# EAGLE design arduino-ss-usbmod-zif (EAGLE 7.7.0)
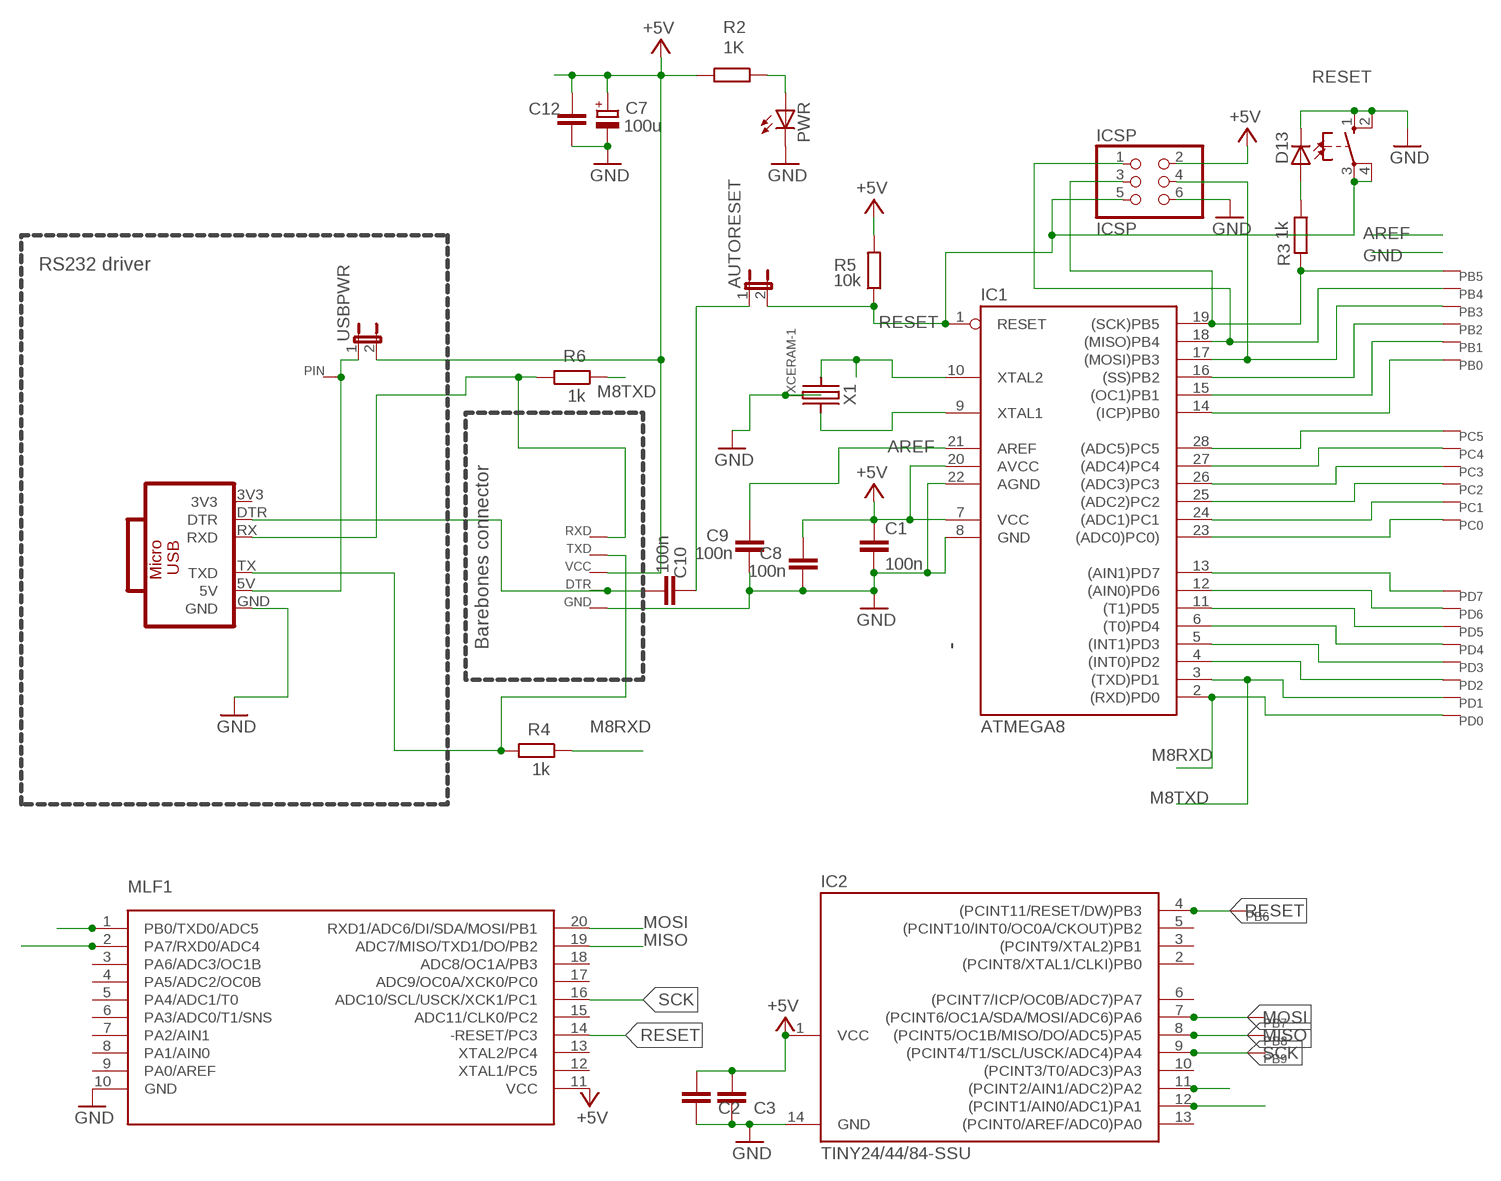
[diagram p0: schematic, sheet 1]

## Parts
AUTORESET  JUMPER-2PTH  [1X02]
C1  100n  C-EU050-025X075  [C050-025X075]
C2  100n  C-EU050-025X075  [C050-025X075]
C3  100n  C-EUC1812  [C1812]
C7  100u  CPOL-EUE3.5-8  [E3,5-8]
C8  100n  C-EU050-025X075  [C050-025X075]
C9  100n  C-EU050-025X075  [C050-025X075]
C10  100n  C-EU050-025X075  [C050-025X075]
C12  100n  C-EU050-025X075  [C050-025X075]
D13  LED3MM  [LED3MM]
DTR  WIRER  [GENERIC-RD-1]
GND  WIRER  [GENERIC-RD-1]
IC1  ATMEGA8  AT90S4433ZIF  [ZIF28/3]
IC2  TINY24/44/84-SSU  [SOIC14]
ICSP  ICSP  PINHD-2X3  [2X03]
MLF1  ATTINY1634SOIC20  [SOIC20]
MOD1  CH340E-MODNOHOLES  [CH340E-MOD-NOHOLES]
PB0  WIRE-VIA11  [VIA11]
PB1  WIRE-VIA11  [VIA11]
PB2  WIRE-VIA11  [VIA11]
PB3  WIRE-VIA11  [VIA11]
PB4  WIRE-VIA11  [VIA11]
PB5  WIRE-VIA11  [VIA11]
PB6  WIRE-VIA11  [VIA11]
PB7  WIRE-VIA11  [VIA11]
PB8  WIRE-VIA11  [VIA11]
PB9  WIRE-VIA11  [VIA11]
PC0  WIRER  [GENERIC-RD-1]
PC1  WIRE-VIA11  [VIA11]
PC2  WIRE-VIA11  [VIA11]
PC3  WIRE-VIA11  [VIA11]
PC4  WIRE-VIA11  [VIA11]
PC5  WIRE-VIA11  [VIA11]
PD0  WIRE-VIA11  [VIA11]
PD1  WIRE-VIA11  [VIA11]
PD2  WIRE-VIA11  [VIA11]
PD3  WIRE-VIA11  [VIA11]
PD4  WIRE-VIA11  [VIA11]
PD5  WIRE-VIA11  [VIA11]
PD6  WIRE-VIA11  [VIA11]
PD7  WIRE-VIA11  [VIA11]
PIN  WIRER  [GENERIC-RD-1]
PWR  LED3MM  [LED3MM]
R2  1K  R-EU_0207/7  [0207/7]
R3  1k  R-EU_0204/5  [0204/5]
R4  1k  R-EU_0207/7  [0207/7]
R5  10k  R-EU_0207/7  [0207/7]
R6  1k  R-EU_0207/7  [0207/7]
RESET  10-XX  [B3F-10XX]
RXD  WIRER  [GENERIC-RD-1]
TXD  WIRER  [GENERIC-RD-1]
USBPWR  JUMPER-2PTH  [1X02]
VCC  WIRE-VIA11  [VIA11]
X1  XCERAM-1  [XTAL-3]

## Nets
+5V [power]: C1.1 C2.1 C3.1 C7.+ C8.2 C12.2 IC1.7(VCC) IC1.20(AVCC) IC2.1(VCC) ICSP.2 MLF1.11(VCC) R2.2 R5.2 USBPWR.2 VCC.P$1
AREF: C9.2 IC1.21(AREF)
DTR: C10.1 DTR.P$1 MOD1.DTR
GND [power]: C1.2 C2.2 C3.2 C7.- C8.1 C9.1 C12.1 D13.K(C) GND.P$1 IC1.8(GND) IC1.22(AGND) IC2.14(GND) ICSP.6 MLF1.10(GND) MOD1.GND PWR.K(C) RESET.1(S) RESET.2(S1) X1.P$2(GND)
M8RXD: IC1.2((RXD)PD0) IC2.11((PCINT2/AIN1/ADC2)PA2) MLF1.1(PB0/TXD0/ADC5) PD0.P$1 R4.1
M8TXD: IC1.3((TXD)PD1) IC2.12((PCINT1/AIN0/ADC1)PA1) MLF1.2(PA7/RXD0/ADC4) PD1.P$1 R6.1
MISO: IC1.18((MISO)PB4) IC2.8((PCINT5/OC1B/MISO/DO/ADC5)PA5) ICSP.1 MLF1.19(ADC7/MISO/TXD1/DO/PB2) PB4.P$1 PB8.P$1
MOSI: IC1.17((MOSI)PB3) IC2.7((PCINT6/OC1A/SDA/MOSI/ADC6)PA6) ICSP.4 MLF1.20(RXD1/ADC6/DI/SDA/MOSI/PB1) PB3.P$1 PB7.P$1
N$1: D13.A R3.1
N$3: PWR.A R2.1
N$4: AUTORESET.1 C10.2
N$5: IC1.14((ICP)PB0) PB0.P$1
N$6: IC1.9(XTAL1) X1.P$3
N$7: IC1.10(XTAL2) X1.P$1
N$10: IC1.4((INT0)PD2) PD2.P$1
N$11: IC1.5((INT1)PD3) PD3.P$1
N$12: IC1.6((T0)PD4) PD4.P$1
N$13: IC1.11((T1)PD5) PD5.P$1
N$14: IC1.12((AIN0)PD6) PD6.P$1
N$15: IC1.13((AIN1)PD7) PD7.P$1
N$16: IC1.23((ADC0)PC0)) PC0.P$1
N$17: IC1.24((ADC1)PC1) PC1.P$1
N$18: IC1.25((ADC2)PC2) PC2.P$1
N$19: IC1.26((ADC3)PC3) PC3.P$1
N$20: IC1.27((ADC4)PC4) PC4.P$1
N$21: IC1.28((ADC5)PC5) PC5.P$1
N$22: IC1.15((OC1)PB1) PB1.P$1
N$26: MOD1.TX(TXD) R4.2 TXD.P$1
N$27: MOD1.RX(RXD) R6.2 RXD.P$1
PIN [power]: MOD1.5V PIN.P$1 USBPWR.1
RESET: AUTORESET.2 IC1.1(RESET) IC2.4((PCINT11/RESET/DW)PB3) ICSP.5 MLF1.14(-RESET/PC3) PB6.P$1 R5.1 RESET.3(P) RESET.4(P1)
SCK: IC1.19((SCK)PB5) IC2.9((PCINT4/T1/SCL/USCK/ADC4)PA4) ICSP.3 MLF1.16(ADC10/SCL/USCK/XCK1/PC1) PB5.P$1 PB9.P$1 R3.2
SS: IC1.16((SS)PB2) PB2.P$1
Unconnected: IC2.2((PCINT8/XTAL1/CLKI)PB0) IC2.3((PCINT9/XTAL2)PB1) IC2.5((PCINT10/INT0/OC0A/CKOUT)PB2) IC2.6((PCINT7/ICP/OC0B/ADC7)PA7) IC2.10((PCINT3/T0/ADC3)PA3) IC2.13((PCINT0/AREF/ADC0)PA0) MLF1.3(PA6/ADC3/OC1B) MLF1.4(PA5/ADC2/OC0B) MLF1.5(PA4/ADC1/T0) MLF1.6(PA3/ADC0/T1/SNS) MLF1.7(PA2/AIN1) MLF1.8(PA1/AIN0) MLF1.9(PA0/AREF) MLF1.12(XTAL1/PC5) MLF1.13(XTAL2/PC4) MLF1.15(ADC11/CLK0/PC2) MLF1.17(ADC9/OC0A/XCK0/PC0) MLF1.18(ADC8/OC1A/PB3)

## Notes on the sheet
- RS232 driver
- Barebones connector

## Power pins joined to a net without a drawn wire
3V3: MOD1.3V3

## Library data of the parts
AUTORESET USBPWR = SparkFun:JUMPER-2: Jumper Basic 0.1" spaced jumper. Use with breakaway headers.
C1-C3 C8-C10 C12 = my-rcl:C-EU: CAPACITOR, European symbol
C7 = my-rcl:CPOL-EU: POLARIZED CAPACITOR, European symbol
D13 PWR = led:LED: LED OSRAM: - CHIPLED LG R971, LG N971, LY N971, LG Q971, LY Q971, LO R971, LY R971 LH N974, LH R974 LS Q976, LO Q976, LY Q976 LO Q996 - Hyper CHIPLED LW Q18S LB Q993, LB Q99A, LB R99A - SideLED LS A670, LO A670, LY A670, LG A670, LP A670 LB A673, LV A673, LT A673, LW A673 LH A674 LY A675 LS A676, LA A676, LO A676, LY A676, LW A676 LS A679, LY A679, LG A679 - Hyper Micro SIDELED® LS Y876, LA Y876, LO Y876, LY Y876 LT Y87S - SmartLED LW L88C, LW L88S LB L89C, LB L89S, LG L890 LS L89K, LO L89K, LY L89K LS L896, LA L896, LO L896, LY L896 - TOPLED LS T670, LO T670, LY T670, LG T670, LP T670 LSG T670, LSP T670, LSY T670, LOP T670, LYG T670 LG T671, LOG T671, LSG T671 LB T673, LV T673, LT T673, LW T673 LH T674 LS T676, LA T676, LO T676, LY T676, LB T676, LH T676, LSB T676, LW T676 LB T67C, LV T67C, LT T67C, LS T67K, LO T67K, LY T67K, LW E67C LS E67B, LA E67B, LO E67B, LY E67B, LB E67C, LV E67C, LT E67C LW T67C LS T679, LY T679, LG T679 LS T770, LO T770, LY T770, LG T770, LP T770 LB T773, LV T773, LT T773, LW T773 LH T774 LS E675, LA E675, LY E675, LS T675 LS T776, LA T776, LO T776, LY T776, LB T776 LHGB T686 LT T68C, LB T68C - Hyper Mini TOPLED® LB M676 - Mini TOPLED Santana® LG M470 LS M47K, LO M47K, LY M47K Source: http://www.osram.convergy.de/
DTR GND PB0 PB1-PB9 PC0 PC1-PC5 PD0 PD1-PD7 PIN RXD TXD VCC = mylib4:WIRE: Pad for a wire offboard
IC1 = atmel:AT90S4433: MICROCONTROLLER 4 Kbytes FLASH 128 bytes SRAM 256 bytes EEPROM UART 6-channel 10 bit ADC
IC2 = avr-7:TINY24/44/84
ICSP = pinhead:PINHD-2X3: PIN HEADER
MLF1 = attiny1634:ATTINY1634
MOD1 = mini-usb:CH340E-MOD
R2-R6 = my-rcl:R-EU_: RESISTOR, European symbol
RESET = switch-omron:10-XX: OMRON SWITCH
X1 = mylib4:XCERAM: Ceramic resonator with built-in caps

## Net classes
0 default: width 0.5 mm
1 power: width 0.6 mm

## Board
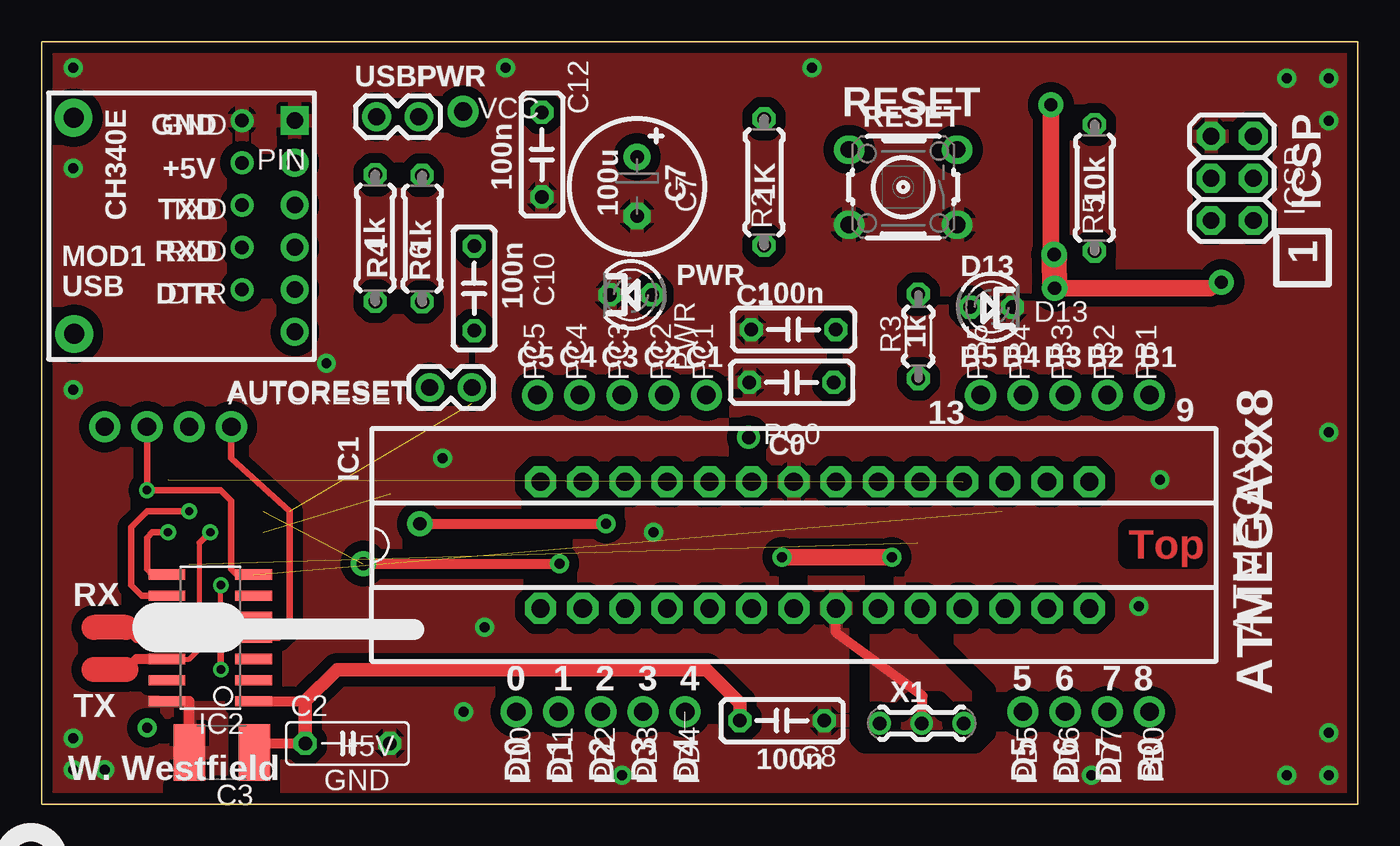
[diagram p1: board, top side]
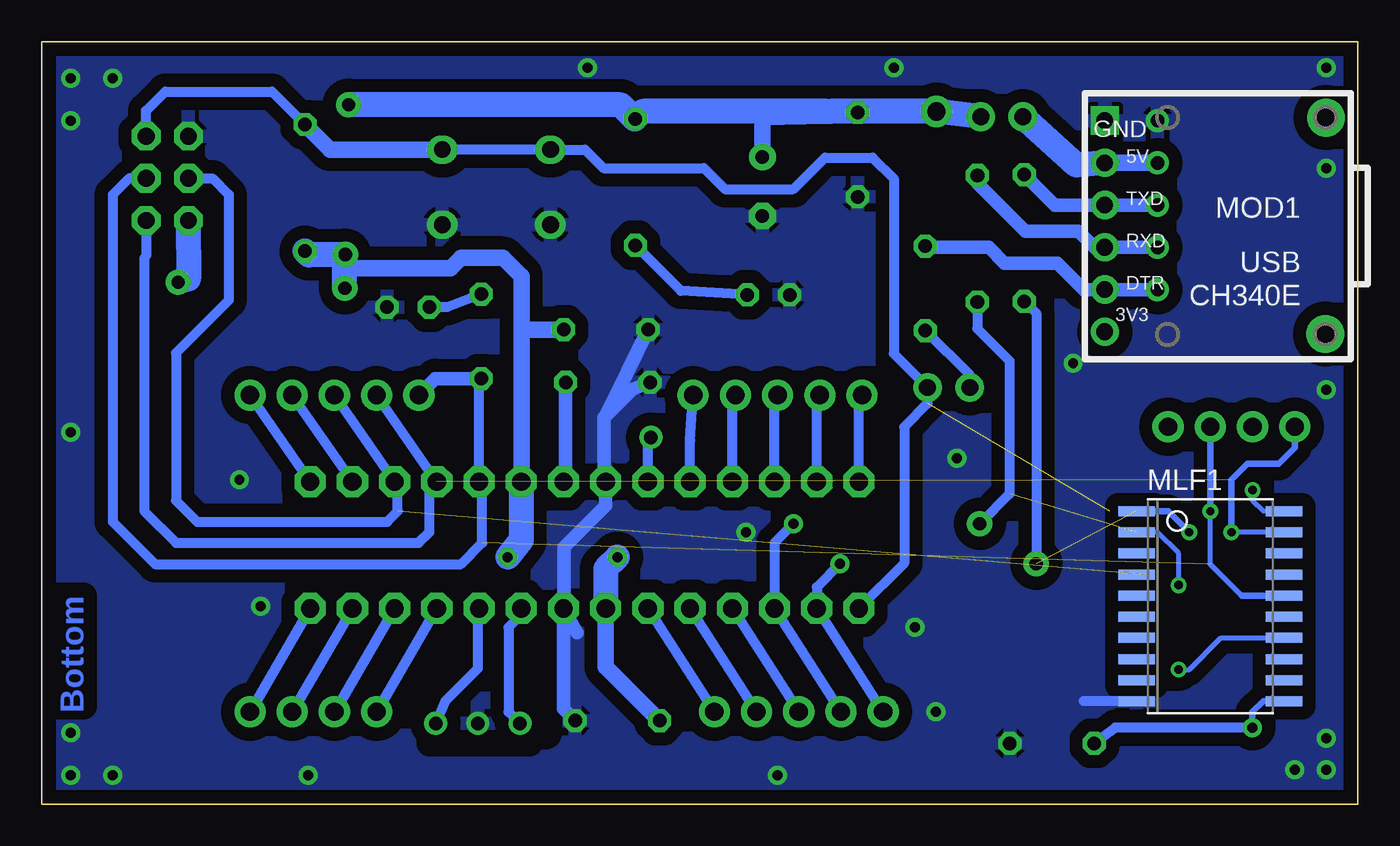
[diagram p2: board, bottom side, seen from below]

Size 79.21 x 45.87 mm. Coordinates in mm from the lower left corner, seen from the top.
Outline: 0,0 0,45.87 79.21,45.87 79.21,0 0,0
Copper layers (1*16): Top 0.035mm / dielectric 1.5mm / Bottom 0.035mm
Design rules "default *": minimum track width 10mil, minimum drill 0.8mm, track to track 0.35mm, track to pad 0.35mm, pad to pad 0.35mm, via to via 8mil, smd to smd 8mil, copper to edge 20mil, drill to drill 8mil, minimum pad ring 5mil, minimum via ring 8mil, stop-mask expansion 4mil, vias tented up to drill 0.65mm, thermal gap 10mil
tRestrict: 12 lines
bRestrict: 2 lines

### Footprints (pad centres in the part's own frame; a part is rotated, then mirrored left to right if it is on the bottom)
1X02 = drill 1.016: 1 0,0; 2 2.54,0
C050-025X075 = drill 0.813 octagon: 1 -2.54,0; 2 2.54,0
C1812 = smd 1.9 x 3.4: 1 -1.95,0; 2 1.95,0
E3,5-8 = drill 0.813 pad 1.6: + -1.778,0 | drill 0.813 pad 1.6 octagon: - 1.778,0
LED3MM = drill 0.813 octagon: A -1.27,0; K 1.27,0
GENERIC-RD-1 = drill 0.813: P$1 0,0
ZIF28/3 = drill 1.1 pad 1.6 octagon: 1 -16.51,-3.81; 2 -13.97,-3.81; 3 -11.43,-3.81; 4 -8.89,-3.81; 5 -6.35,-3.81; 6 -3.81,-3.81; 7 -1.27,-3.81; 8 1.27,-3.81; 9 3.81,-3.81; 10 6.35,-3.81; 11 8.89,-3.81; 12 11.43,-3.81; 13 13.97,-3.81; 14 16.51,-3.81; 15 16.51,3.81; 16 13.97,3.81; 17 11.43,3.81; 18 8.89,3.81; 19 6.35,3.81; 20 3.81,3.81; 21 1.27,3.81; 22 -1.27,3.81; 23 -3.81,3.81; 24 -6.35,3.81; 25 -8.89,3.81; 26 -11.43,3.81; 27 -13.97,3.81; 28 -16.51,3.81
SOIC14 = smd 0.61 x 2.21: 1 -3.81,-2.603; 2 -2.54,-2.603; 3 -1.27,-2.603; 4 0,-2.603; 5 1.27,-2.603; 6 2.54,-2.603; 7 3.81,-2.603; 8 3.81,2.603; 9 2.54,2.603; 10 1.27,2.603; 11 0,2.603; 12 -1.27,2.603; 13 -2.54,2.603; 14 -3.81,2.603
2X03 = drill 1.016 octagon: 1 -2.54,-1.27; 2 -2.54,1.27; 3 0,-1.27; 4 0,1.27; 5 2.54,-1.27; 6 2.54,1.27
SOIC20 = smd 0.6 x 2.2: 1 -1.905,-4.445; 2 -0.635,-4.445; 3 0.635,-4.445; 4 1.905,-4.445; 5 3.175,-4.445; 6 4.445,-4.445; 7 5.715,-4.445; 8 6.985,-4.445; 9 8.255,-4.445; 10 9.525,-4.445; 11 9.525,4.445; 12 8.255,4.445; 13 6.985,4.445; 14 5.715,4.445; 15 4.445,4.445; 16 3.175,4.445; 17 1.905,4.445; 18 0.635,4.445; 19 -0.635,4.445; 20 -1.905,4.445
CH340E-MOD-NOHOLES = drill 1: 3V3 6.35,6.35; 5V 6.35,-3.81; DTR 6.35,3.81; RX 6.35,1.27; TX 6.35,-1.27 | drill 1 square: GND 6.35,-6.35
VIA11 = drill 1.1: P$1 0,0
0207/7 = drill 0.813 octagon: 1 -3.81,0; 2 3.81,0
0204/5 = drill 0.813 octagon: 1 -2.54,0; 2 2.54,0
B3F-10XX = drill 1.016 long: 1 -3.251,2.261; 2 3.251,2.261; 3 -3.251,-2.261; 4 3.251,-2.261
XTAL-3 = drill 0.813: P$1 0,2.54; P$2 0,0; P$3 0,-2.54

### Placement (x,y rotation side)
AUTORESET  23.36,25.07 0 top
C1  45.25,28.55 180 top
C2  18.41,3.65 0 top
C3  10.85,3.11 180 top
C7  35.83,37.16 270 top
C8  44.56,5.02 180 top
C9  45.13,25.37 0 top
C10  26.03,31.03 270 top
C12  30.11,39.07 90 top
D13  57.16,29.9 0 top
DTR  12.06,30.96 180 top
GND  12.06,41.12 180 top
IC1  46.54,15.59 0 top
IC2  10.15,10 90 top
ICSP  71.64,37.65 90 top
MLF1  8.88,15.72 270 bottom
MOD1  8.88,34.77 180 bottom
PB0  66.67,5.56 270 top
PB1  66.67,24.61 90 top
PB2  64.13,24.61 90 top
PB3  61.59,24.61 90 top
PB4  59.05,24.61 90 top
PB5  56.51,24.61 90 top
PB6  11.42,22.7 0 top
PB7  6.34,22.7 0 top
PB8  3.8,22.7 0 top
PB9  8.88,22.7 0 top
PC0  42.54,22.07 0 top
PC1  40,24.61 0 top
PC2  37.46,24.61 90 top
PC3  34.92,24.61 90 top
PC4  32.38,24.61 90 top
PC5  29.84,24.61 90 top
PD0  28.57,5.56 270 top
PD1  31.11,5.56 270 top
PD2  33.65,5.56 270 top
PD3  36.19,5.56 270 top
PD4  38.73,5.56 270 top
PD5  59.05,5.56 270 top
PD6  61.59,5.56 270 top
PD7  64.13,5.56 270 top
PIN  12.06,38.58 0 top
PWR  35.47,30.63 180 top
R2  43.48,37.42 90 top
R3  52.76,28.14 270 top
R4  20.07,34.06 90 top
R5  63.36,37.07 270 top
R6  22.9,34.02 90 top
RESET  51.85,37.12 180 top
RXD  12.06,33.5 180 top
TXD  12.06,36.04 180 top
USBPWR  20.16,41.35 0 top
VCC  25.36,41.67 0 top
X1  52.96,4.87 270 top

### Tracks (layer width: path | path; a pad name or v marks a point on that pad's centre or on a via)
+5V  (via drill 0.6, 0.8)
  Top 0.6: 15.87,6.19 IC2.1 12.06,6.19 | C3.1 13.34,3.65 C2.1
  Top 0.8: C8.2 42.02,6.08 40,8.1 17.77,8.1 15.87,6.19 C2.1
  Top 1: v70.99,31.4 70.31,31.03 v60.96,31.03 | v60.73,42.07 60.73,33.27 v60.93,33.07 | v51.16,14.87 v44.56,14.87
  Top 1.5: v60.96,31.03 60.95,32.86
  Bottom 0.4: MLF1.11 5.71,6.19 6.34,5.56 v6.34,4.6
  Bottom 0.6: C12.2 31.68,41.61 31.74,41.67 | v6.34,4.6 14.6,4.6 C2.1
  Bottom 0.8: IC1.20 50.33,19.4
  Bottom 1: 31.74,41.67 31.96,41.67 | 43.04,41.67 R2.2 43.52,41.23 | C7.+ 35.83,41.59 | 45.16,11.89 IC1.7 45.26,8.27 C8.2 | 60.96,32.23 54.6,32.23 53.97,32.86 51.43,32.86 50.33,31.76 50.33,28.73 | 50.33,19.4 50.33,28.73 | C1.1 50.14,28.55 50.33,28.73
  Bottom 1.5: ICSP.2 70.36,31.6 v70.99,31.4 | USBPWR.2 VCC.P$1 31.74,41.67 | 43.04,41.67 31.96,41.67 35.83,41.59 | 43.52,41.23 44.36,42.07 v60.73,42.07 | IC1.20 50.34,15.88 v51.16,14.87 | v60.96,31.03 60.96,32.23 60.96,33.04 | 60.96,33.04 v60.93,33.07 | 60.96,33.04 63.13,33.04 R5.2 | v44.56,14.87 45.26,14.16 IC1.7
AREF
  Bottom 0.8: IC1.21 47.67,19.4 C9.2
DTR
  Bottom 0.8: DTR.P$1 MOD1.DTR 16.5,30.96 18.09,32.54 21.27,32.54 22.22,33.5 25.96,33.5 C10.1
GND  (via drill 0.6)
  Top 0.6: C3.2 8.88,6.19 | 8.88,6.19 IC2.14 | 8.88,6.19 8.88,3.65 | X1.P$2 53.02,6.51 47.8,10.32 IC1.8
  Bottom 0.6: MLF1.10 16.5,6.19
  Bottom 0.8: C9.1 43.65,24.97 45.25,23.38 | 45.25,23.38 45.36,23.27 45.36,19.49 IC1.22 45.26,17.96 47.76,15.47 47.76,11.83 IC1.8 | C1.2 45.25,23.38 | IC1.8 47.8,5.73 C8.1 | IC1.8 46.98,10.32
  other vias: 1.9,44.29 1.9,24.92 17.14,26.51 36.82,16.35 77.46,1.75 77.46,43.66 74.92,43.66 77.46,4.29 74.92,1.75 77.46,41.12 24.12,20.8 67.3,19.53 26.66,10.64 66.03,11.91 27.93,44.29 46.35,44.29 25.39,5.56 1.9,2.06 3.8,2.06 1.9,3.97 1.9,38.26 77.46,22.38 63.18,1.75 34.92,1.75
  pour Bottom (isolate 0.8, rank 6): -3.18,47.34 80.8,47.34 80.8,-1.59 -3.18,-1.59
  pour Top (isolate 0.61): -1.28,47.47 -1.28,-0.79 81.27,-0.79 81.27,47.47
M8RXD  (via drill 0.5, 0.6, 0.8)  (1 unrouted)
  Top 0.3: IC2.11 8.88,10 9.52,10.64 9.52,15.72
  Top 0.4: 9.52,15.72 v10.15,16.35
  Top 0.6: v19.36,14.47 v31.16,14.47 | IC2.11 5.71,10 5.07,10.64
  Top 1.5: 5.07,10.64 3.17,10.64
  Bottom 0.4: v10.15,16.35 11.42,17.62 MLF1.1
  Bottom 0.6: R4.1 19.36,29.53 v19.36,14.47 | v31.16,14.47 32.56,13.06 IC1.2 PD0.P$1
M8TXD  (via drill 0.5, 0.6, 0.8)  (1 unrouted)
  Top 0.3: IC2.12 8.88,8.73 10.79,10.64 v10.79,13.18
  Top 0.6: v22.76,16.87 v33.96,16.87 | IC2.12 5.71,8.73 5.07,8.1
  Top 1.5: 5.07,8.1 3.17,8.1
  Bottom 0.3: v10.79,13.18 10.79,15.08 12.06,16.35 MLF1.2
  Bottom 0.6: R6.1 22.9,28.61 20.96,26.67 20.96,18.67 v22.76,16.87 | v33.96,16.87 35.1,15.72 IC1.3 PD1.P$1
MISO  (via drill 0.5)  (1 unrouted)
  Top 0.3: IC2.8 6.66,13.81
  Top 0.4: 6.66,13.81 6.34,14.13 6.34,16.03 6.66,16.35 v7.61,16.35
  Bottom 0.3: MLF1.19 v7.61,16.35
  Bottom 0.4: PB8.P$1 3.8,21.43 4.76,20.48 6.66,20.48 7.61,19.53 v7.61,16.35
  Bottom 0.6: PB4.P$1 IC1.18 55.87,18.95 55.87,16.35 56.51,15.72 71.11,15.72 73.02,17.62 73.02,32.86 72.91,32.97 ICSP.1
MOSI  (via drill 0.5)  (1 unrouted)
  Top 0.4: IC2.7 11.74,13.81 11.42,14.13 11.42,18.26 10.79,18.89 v6.34,18.89 PB7.P$1
  Bottom 0.3: MLF1.20 5.71,17.62 6.34,18.26 v6.34,18.89
  Bottom 0.6: PB3.P$1 IC1.17 57.78,19.21 57.78,17.62 58.41,16.99 69.84,16.99 71.11,18.26 71.11,27.15 67.94,30.32 67.94,36.67 68.91,37.65 ICSP.4 | MLF1.20 3.8,17.62
N$1
  Bottom 0.6: R3.1 54.81,29.9 D13.A
N$3
  Bottom 0.6: PWR.A 40.74,30.87 R2.1
N$4
  Bottom 0.6: C10.2 23.36,25.82 AUTORESET.1
N$5
  Bottom 0.6: IC1.14 PB0.P$1
N$6
  Bottom 0.6: IC1.9 50.34,11.4 51.11,10.64 51.11,5.56 X1.P$3
N$7
  Bottom 0.6: IC1.10 52.96,11.71 52.96,8.15 54.92,6.19 X1.P$1
N$9  (via drill 1.2)
  other vias: 1.92,41.29
N$10
  Bottom 0.6: PD2.P$1 IC1.4
N$11
  Bottom 0.6: PD3.P$1 IC1.5
N$12
  Bottom 0.6: PD4.P$1 IC1.6
N$13
  Bottom 0.6: IC1.11 PD5.P$1
N$14
  Bottom 0.6: IC1.12 PD6.P$1
N$15
  Bottom 0.6: IC1.13 PD7.P$1
N$16
  Bottom 0.6: IC1.23 42.72,21.88 PC0.P$1
N$17
  Bottom 0.6: IC1.24 40.18,21.88 PC1.P$1
N$18
  Bottom 0.6: IC1.25 37.64,24.42 PC2.P$1
N$19
  Bottom 0.6: IC1.26 35.1,24.42 PC3.P$1
N$20
  Bottom 0.6: IC1.27 32.56,24.42 PC4.P$1
N$21
  Bottom 0.6: IC1.28 30.02,24.42 PC5.P$1
N$22
  Bottom 0.6: IC1.15 PB1.P$1
N$23  (via drill 1.2)
  other vias: 1.96,28.28
N$26
  Bottom 0.8: TXD.P$1 MOD1.TX 18.24,36.04 R4.2
N$27
  Bottom 0.8: RXD.P$1 MOD1.RX 15.87,33.5 16.82,34.45 20,34.45 22.85,37.31 22.85,37.78 R6.2
PIN
  Bottom 1: MOD1.5V PIN.P$1
  Bottom 1.5: MOD1.5V 16.93,38.44 USBPWR.1
RESET  (via drill 0.5)  (1 unrouted)
  Top 0.4: v10.79,8.1 10.79,9.37 11.42,10 IC2.4 14.28,10 14.92,10.64 14.92,17.62 11.42,20.8 PB6.P$1
  Bottom 0.3: v10.79,8.1 10.15,8.1 8.25,10 MLF1.14
  Bottom 0.6: ICSP.5 72.91,41.71 71.76,42.87 65.34,42.87 R5.1 | RESET.3 RESET.4 46.52,39.38 45.4,38.26 39.36,38.26 38.09,36.99 33.97,36.99 32.06,38.89 29.2,38.89 27.93,37.62 27.93,27.1 AUTORESET.2 25.9,24.1 27.3,22.7 27.3,14.51 IC1.1
  Bottom 1: RESET.3 61.85,39.38 R5.1
SCK  (via drill 0.5)  (1 unrouted)
  Top 0.4: IC2.9 6.03,12.54 5.39,13.18 5.39,16.67 6.34,17.62 v8.88,17.62
  Bottom 0.3: 6.98,12.54 8.88,14.45 v8.88,17.62
  Bottom 0.4: MLF1.16 6.98,12.54 | v8.88,17.62 PB9.P$1
  Bottom 0.6: R3.2 52.88,25.17 IC1.19 52.7,19.21 52.7,15.72 53.97,14.45 72.38,14.45 74.92,16.99 74.92,36.67 73.95,37.65 ICSP.3
  Bottom 0.8: PB5.P$1 55.52,25.6 R3.2
SS
  Bottom 0.6: IC1.16 PB2.P$1

### Text on the board
Top: Top
Bottom: Bottom
bPlace: 1
tNames: +5V | W. Westfield | GND
Edit History: 20190201 by WestfW: Shrink some more pads. Add silkscreen for LEDs. | 20180804 by WestfW: Board received and tested. Add tStop over the tiny pads | 20180722 by WestfW: refactor to ZIF/etc and send to OSHPark for Fab.
_tSilk: USBPWR | CH340E | GND | RESET | 100u | +5V | C7 | 1K | 10k | TXD | 100n | ICSP | RXD | 1k | 100n | 1 | MOD1 | 1k | DTR | PWR | D13 | USB | 100n | 1k | C5 | C4 | C3 | C2 | C1 | B5 | B4 | B3 | B2 | B1 | AUTORESET | 13 | 9 | C0 | IC1 | RX | 0 | 1 | 2 | 3 | 4 | 5 | 6 | 7 | 8 | ATMEGAxx8 | TX | X1 | D0 | D1 | D2 | D3 | D4 | 100n | D5 | D6 | D7 | B0
_bplace: GND | RSET | +5V | SCK | MOSI | TXD | MISO | RXD | DTR | C5 | C4 | C3 | C2 | C1 | B5 | B4 | B3 | B2 | B1 | MISO | MOSI | SCK | RSET | C0 | 13 | 12 | 11 | 10 | 9 | W. Westfield | 0 | 1 | 2 | 3 | 4 | 5 | 6 | 7 | 8 | D0 | D1 | D2 | D3 | D4 | D5 | D6 | D7 | B0 | +5V | GND